# Altium schematic sheet input.SchDoc
size A4
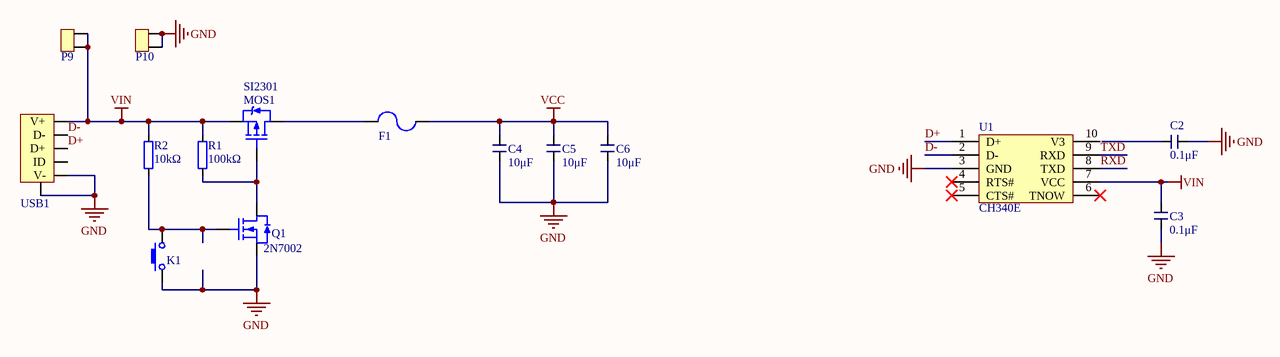
[diagram p0: input.SchDoc]

## Parts
C2  0.1μF  [C_0603]
C3  0.1μF  [C_0603]
C4  10μF  [C_0805]
C5  10μF  [C_0805]
C6  10μF  [C_0805]
F1  A  [F_1812]  (value not drawn)
K1  TACT SWITCH_2_SMD  [TACT SWITCH_2_SMD]  (value not drawn)
MOS1  SI2301  [SOT_23_3]
P9  PIN2  [PIN_2]  (value not drawn)
P10  PIN2  [PIN_2]  (value not drawn)
Q1  2N7002  [SOT_23_3]
R1  100kΩ  [R_0603]
R2  10kΩ  [R_0603]
U1  CH340E  [MSOP_10]
USB1  MICRO USB B  [MICRO USB B]  (value not drawn)

## Nets
GND: C2.1 C3.1 C4.2 C5.2 C6.2 K1.1 P10.1 P10.2 Q1.2(S) U1.3(GND) USB1.0(GND) USB1.5(V-)
VCC: C4.1 C5.1 C6.1 F1.2
VIN: C3.2 MOS1.2(S) P9.1 P9.2 R1.2 R2.2 U1.7(VCC) USB1.1(V+)
D+: U1.1(D+) USB1.3(D+)
D-: U1.2(D-) USB1.2(D-)
RXD: U1.8(TXD)
TXD: U1.9(RXD)
NetF1_1: F1.1 MOS1.3(D)
NetK1_2: K1.2 Q1.1(G) R2.1
NetMOS1_1: MOS1.1(G) Q1.3(D) R1.1

Not connected (* = marked no-connect by the designer): C2 2; U1 4(RTS#)* 5(CTS#)* 6(TNOW)* 10(V3); USB1 4(ID)

## Library data of the parts
C2 C3 = C_0603
C4-C6 = C_0805
F1 = FUSE_1812
R1 R2 = R_0603